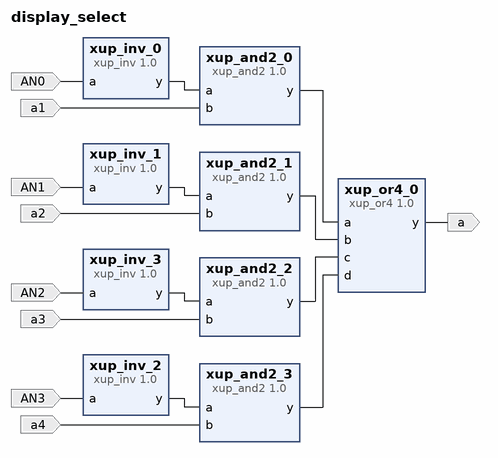
[diagram p0: block diagram of the top level]
# Vivado block design display_select, xc7a35tcpg236-1, Vivado 2021.1
create_bd_design display_select

create_bd_port -dir I AN0
create_bd_port -dir I AN1
create_bd_port -dir I AN2
create_bd_port -dir I AN3
create_bd_port -dir I a1
create_bd_port -dir I a2
create_bd_port -dir I a3
create_bd_port -dir I a4
create_bd_port -dir O a

create_bd_cell -type ip -vlnv xilinx.com:xup:xup_inv:1.0 xup_inv_0
create_bd_cell -type ip -vlnv xilinx.com:xup:xup_inv:1.0 xup_inv_1
create_bd_cell -type ip -vlnv xilinx.com:xup:xup_inv:1.0 xup_inv_2
create_bd_cell -type ip -vlnv xilinx.com:xup:xup_inv:1.0 xup_inv_3
create_bd_cell -type ip -vlnv xilinx.com:xup:xup_and2:1.0 xup_and2_0
create_bd_cell -type ip -vlnv xilinx.com:xup:xup_and2:1.0 xup_and2_1
create_bd_cell -type ip -vlnv xilinx.com:xup:xup_and2:1.0 xup_and2_2
create_bd_cell -type ip -vlnv xilinx.com:xup:xup_and2:1.0 xup_and2_3
create_bd_cell -type ip -vlnv xilinx.com:xup:xup_or4:1.0 xup_or4_0

# ---- connections ----

connect_bd_net -net AN0_1 [get_bd_ports AN0] [get_bd_pins xup_inv_0/a]
connect_bd_net -net AN1_1 [get_bd_ports AN1] [get_bd_pins xup_inv_1/a]
connect_bd_net -net AN2_1 [get_bd_ports AN2] [get_bd_pins xup_inv_3/a]
connect_bd_net -net AN3_1 [get_bd_ports AN3] [get_bd_pins xup_inv_2/a]
connect_bd_net -net a1_1 [get_bd_ports a1] [get_bd_pins xup_and2_0/b]
connect_bd_net -net a2_1 [get_bd_ports a2] [get_bd_pins xup_and2_1/b]
connect_bd_net -net a3_1 [get_bd_ports a3] [get_bd_pins xup_and2_2/b]
connect_bd_net -net a4_1 [get_bd_ports a4] [get_bd_pins xup_and2_3/b]
connect_bd_net [get_bd_pins xup_and2_0/y] [get_bd_pins xup_or4_0/a]
connect_bd_net [get_bd_pins xup_and2_1/y] [get_bd_pins xup_or4_0/b]
connect_bd_net [get_bd_pins xup_and2_2/y] [get_bd_pins xup_or4_0/c]
connect_bd_net [get_bd_pins xup_and2_3/y] [get_bd_pins xup_or4_0/d]
connect_bd_net [get_bd_pins xup_inv_0/y] [get_bd_pins xup_and2_0/a]
connect_bd_net [get_bd_pins xup_inv_1/y] [get_bd_pins xup_and2_1/a]
connect_bd_net [get_bd_pins xup_inv_2/y] [get_bd_pins xup_and2_3/a]
connect_bd_net [get_bd_pins xup_inv_3/y] [get_bd_pins xup_and2_2/a]
connect_bd_net [get_bd_pins xup_or4_0/y] [get_bd_ports a]

validate_bd_design
save_bd_design
